# Altium schematic sheet Flyback_schematic.SchDoc: Flyback Converter - EduKit
size A3; Author: DJT, SK & JL; CompanyName: The University of Auckland; Organization: Dept. ECSE; Address1: The University of Auckland; Address2: 20 Symonds Street; Address3: Auckland; Address4: New Zealand; Revision: 2.0; SheetNumber: 1; SheetTotal: 1
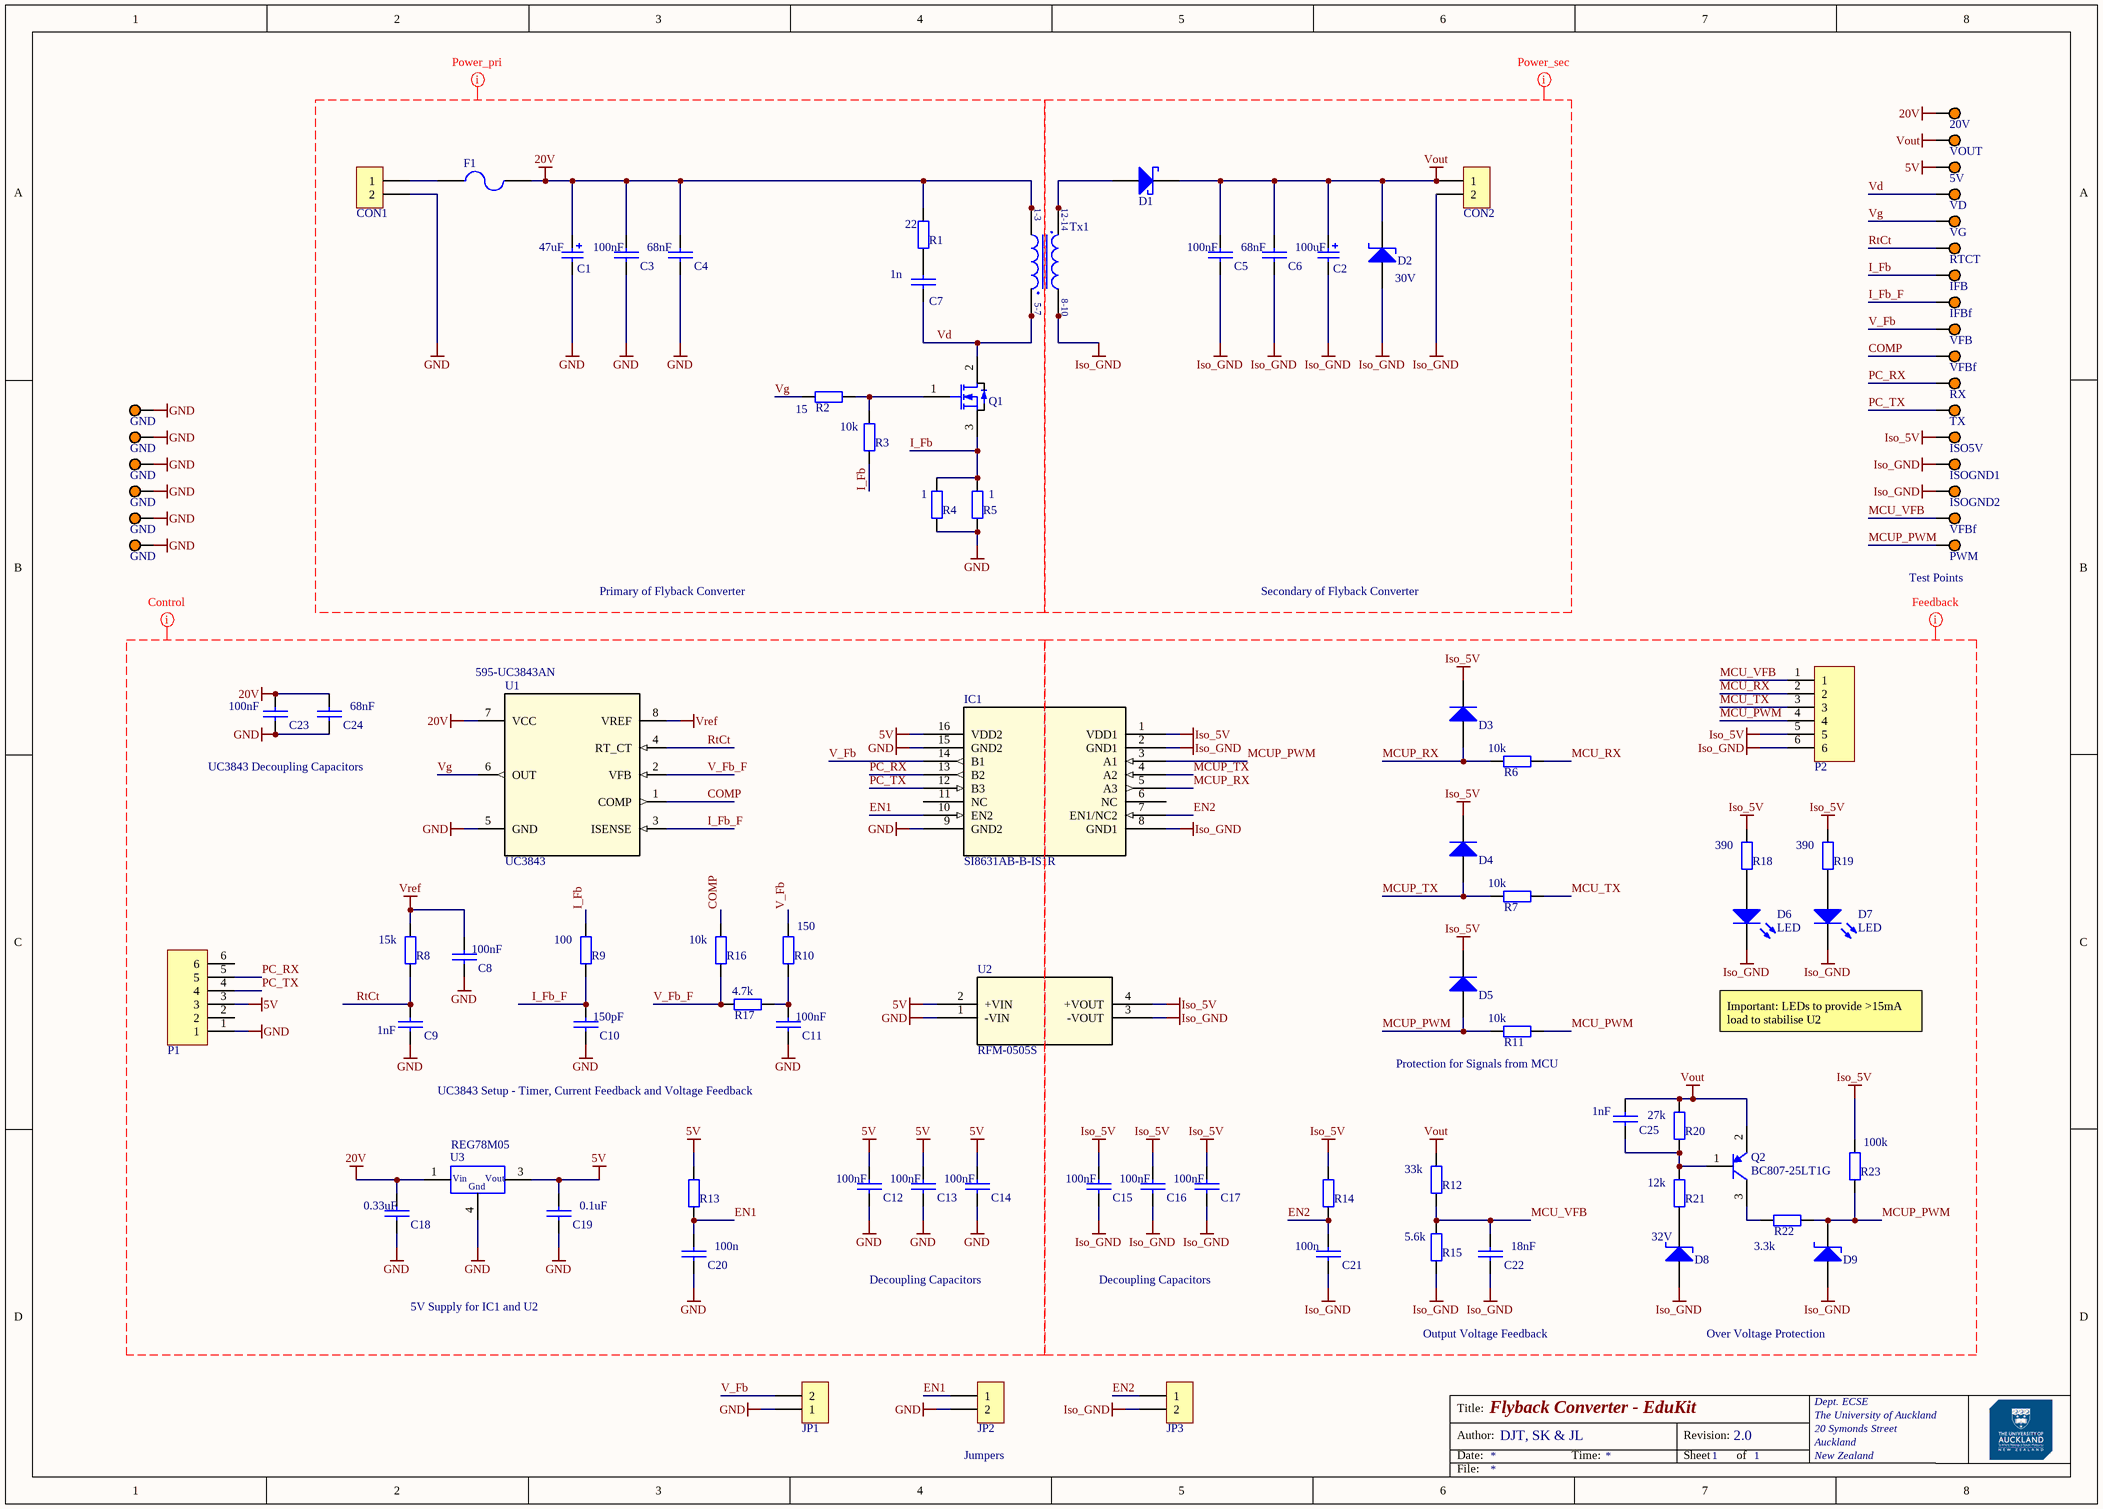
[diagram p0: Flyback_schematic.SchDoc]

## Parts
C1  47uF  [CR05]
C2  100uF  [CR05]
C3  100nF  [C1210]
C4  68nF  [C1210]
C5  100nF  [C1210]
C6  68nF  [C1210]
C7  1n  [C1210]
C8  100nF  [C0805]
C9  1nF  [C0805]
C10  150pF  [C0805]
C11  100nF  [C0805]
C12  100nF  [C0805]
C13  100nF  [C0805]
C14  100nF  [C0805]
C15  100nF  [C0805]
C16  100nF  [C0805]
C17  100nF  [C0805]
C18  0.33uF  [C0805]
C19  0.1uF  [C0805]
C20  100n  [C0805]
C21  100n  [C0805]
C22  18nF  [C0805]
C23  100nF  [C0805]
C24  68nF  [C0805]
C25  1nF  [C0805]
CON1  Header 2X1  [HDR2X1_5]  (value not drawn)
CON2  Header 2X1  [HDR2X1_5]  (value not drawn)
D1  SDT5H100P5  [PowerDI5]  (value not drawn)
D2  30V  [SOD123]
D3  1N4148  [SOD123]  (value not drawn)
D4  1N4148  [SOD123]  (value not drawn)
D5  1N4148  [SOD123]  (value not drawn)
D6  LED  [LED0805]
D7  LED  [LED0805]
D8  32V  [SOD123]
D9  Zener  [SOD123]  (value not drawn)
F1  Fuse Resettable  [0ZCF Series]  (value not drawn)
GND1  GND  [Testpoint - 1mm]
GND2  GND  [Testpoint - 1mm]
GND3  GND  [Testpoint - 1mm]
GND4  GND  [Testpoint - 1mm]
GND5  GND  [Testpoint - 1mm]
GND6  GND  [Testpoint - 1mm]
IC1  SI8631AB-B-IS1R  [SOIC16]
JP1  Header 2X1  [HDR2X1_2P54]  (value not drawn)
JP2  Header 2X1  [HDR2X1_2P54]  (value not drawn)
JP3  Header 2X1  [HDR2X1_2P54]  (value not drawn)
P1  Header 6X1  [HDR6X1_2P54]  (value not drawn)
P2  Header 6X1  [HDR6X1_2P54]  (value not drawn)
Q1  MOSFET  [TO220]  (value not drawn)
Q2  BC807-25LT1G  [SOT23SM]
R1  22  [R1206]
R2  15  [R0805]
R3  10k  [R0805]
R4  1  [R1206]
R5  1  [R1206]
R6  10k  [R0805]
R7  10k  [R0805]
R8  15k  [R0805]
R9  100  [R0805]
R10  150  [R0805]
R11  10k  [R0805]
R12  33k  [R0805]
R13  Resistor 0805  [R0805]  (value not drawn)
R14  Resistor 0805  [R0805]  (value not drawn)
R15  5.6k  [R0805]
R16  10k  [R0805]
R17  4.7k  [R0805]
R18  390  [R0805]
R19  390  [R0805]
R20  27k  [R0805]
R21  12k  [R0805]
R22  3.3k  [R0805]
R23  100k  [R0805]
TP1  20V  [Testpoint - 1mm]
TP2  VOUT  [Testpoint - 1mm]
TP3  VG  [Testpoint - 1mm]
TP4  PWM  [Testpoint - 1mm]
TP6  IFB  [Testpoint - 1mm]
TP7  VFB  [Testpoint - 1mm]
TP8  RX  [Testpoint - 1mm]
TP9  5V  [Testpoint - 1mm]
TP10  ISO5V  [Testpoint - 1mm]
TP11  ISOGND1  [Testpoint - 1mm]
TP12  TX  [Testpoint - 1mm]
TP13  ISOGND2  [Testpoint - 1mm]
TP14  RTCT  [Testpoint - 1mm]
TP15  IFBf  [Testpoint - 1mm]
TP16  VFBf  [Testpoint - 1mm]
TP17  VFBf  [Testpoint - 1mm]
Tx1  Inductor  [ETD34]  (value not drawn)
U1  UC3843  Supplier Part Number 1: 595-UC3843AN  [DIP-8]
U2  RFM-0505S  [RFM-0505S_RCP]
U3  REG78M05  [TO252]
VD  VD  [Testpoint - 1mm]

## Nets
5V: C12.2 C13.2 C14.2 C19.2 IC1.16(VDD2) P1.3 R13.2 TP9.1 U2.2(+VIN) U3.3(Vout)
20V: C1.1 C3.2 C4.2 C18.2 C23.2 C24.2 F1.2 R1.2 TP1.1 Tx1.1 Tx1.2 Tx1.3 U1.7(VCC) U3.1(Vin)
GND: C1.2 C3.1 C4.1 C8.1 C9.1 C10.1 C11.1 C12.1 C13.1 C14.1 C18.1 C19.1 C20.1 C23.1 C24.1 CON1.2 GND1.1 GND2.1 GND3.1 GND4.1 GND5.1 GND6.1 IC1.9(GND2) IC1.15(GND2) JP1.1 JP2.2 P1.1 R4.1 R5.1 U1.5(GND) U2.1(-VIN) U3.4(Gnd)
Iso_5V: C15.2 C16.2 C17.2 D3.2 D4.2 D5.2 IC1.1(VDD1) P2.5 R14.2 R18.2 R19.2 R23.2 TP10.1 U2.4(+VOUT)
Iso_GND: C2.2 C5.1 C6.1 C15.1 C16.1 C17.1 C21.1 C22.1 CON2.2 D2.1(A) D6.2(K) D7.2(K) D8.1(A) D9.1(A) IC1.2(GND1) IC1.8(GND1) JP3.2 P2.6 R15.1 TP11.1 TP13.1 Tx1.8 Tx1.9 Tx1.10 U2.3(-VOUT)
Vout: C2.1 C5.2 C6.2 C25.2 CON2.1 D1.3(K) D2.2(K) Q2.2(E) R12.2 R20.2 TP2.1
Vref: C8.2 R8.1 U1.8(VREF)
COMP: R16.2 TP16.1 U1.1(COMP)
EN1: C20.2 IC1.10(EN2) JP2.1 R13.1
EN2: C21.2 IC1.7(EN1/NC2) JP3.1 R14.1
I_Fb: Q1.3(S) R3.1 R4.2 R5.2 R9.2 TP6.1
I_Fb_F: C10.2 R9.1 TP15.1 U1.3(ISENSE)
MCU_PWM: P2.4 R11.1
MCU_RX: P2.2 R6.1
MCU_TX: P2.3 R7.1
MCU_VFB: C22.2 P2.1 R12.1 R15.2 TP17.1
MCUP_PWM: D5.1 D9.2(K) IC1.3(A1) R11.2 R22.2 R23.1 TP4.1
MCUP_RX: D3.1 IC1.5(A3) R6.2
MCUP_TX: D4.1 IC1.4(A2) R7.2
PC_RX: IC1.13(B2) P1.5 TP8.1
PC_TX: IC1.12(B3) P1.4 TP12.1
RtCt: C9.2 R8.2 TP14.1 U1.4(RT_CT)
V_Fb: IC1.14(B1) JP1.2 R10.2 TP7.1
V_Fb_F: R16.1 R17.2 U1.2(VFB)
Vd: C7.1 Q1.2(D) Tx1.5 Tx1.6 Tx1.7 VD.1
Vg: R2.1 TP3.1 U1.6(OUT)
NetC7_2: C7.2 R1.1
NetC11_2: C11.2 R10.1 R17.1
NetC25_1: C25.1 Q2.1(B) R20.1 R21.2
NetCON1_1: CON1.1 F1.1
NetD1_1: D1.1(A) Tx1.12 Tx1.13 Tx1.14
NetD6_1: D6.1(A) R18.1
NetD7_1: D7.1(A) R19.1
NetD8_2: D8.2(K) R21.1
NetQ1_1: Q1.1(G) R2.2 R3.2
NetQ2_3: Q2.3(C) R22.1

Not connected (* = marked no-connect by the designer): IC1 6(NC) 11(NC); P1 2 6

## Layout directives
net class Power_pri: 20V, GND, I_Fb, Vd, Vg
net class Power_sec: Iso_GND, Vout
net class Control_pri: 5V, 20V, COMP, EN1, GND, I_Fb, I_Fb_F, PC_RX, PC_TX, RtCt, V_Fb, V_Fb_F, Vg, Vref
net class Feedback_sec: EN2, Iso_5V, Iso_GND, MCU_PWM, MCU_RX, MCU_TX, MCU_VFB, MCUP_PWM, MCUP_RX, MCUP_TX, Vout

## Notes on the sheet
- (near TP4) Test Points
- Primary of Flyback Converter
- Secondary of Flyback Converter
- UC3843 Decoupling Capacitors
- Important: LEDs to provide >15mA load to stabilise U2
- UC3843 Setup - Timer, Current Feedback and Voltage Feedback
- (near R11) Protection for Signals from MCU
- 5V Supply for IC1 and U2
- Decoupling Capacitors
- Output Voltage Feedback
- Over Voltage Protection
- (near JP2) Jumpers
- Title:
- Author:
- Date:
- Time:
- Revision:
- Sheet
- of
- File:
- (in symbol Transformer EFD34) 1-3; 12-14; 8-10; 5-7

## Library data of the parts
C1 C2 = ECAP
C3-C7 = CCAP1210
C8-C25 = CCAP0805
CON1 CON2 JP1-JP3 = HDR2X1
D1 = SDT5H100P5: Schottky Diode; Supplier 1: Digi-Key; Supplier Part Number 1: SDT5H100P5-7DIDKR-ND
D2 D8 D9 = Zener: Zener Diode
D3-D5 = 1N4148: Signal Diode - 1N4148; Supplier 1: Digi-Key; Supplier Part Number 1: 1N4148WTCT-ND
F1 = FuseResettable 0ZCF0100AF2A: PTC RESET FUSE 60V 1A 2920; Manufacturer: Bel Fuse Inc.; Type: Surface mount; Value: 60V/1A; MPN: 0ZCF0100AF2A; Part Description: PTC RESET FUSE 60V 1A 2920; Supplier Part Number 2: 530-0ZCF0100AF2A; Supplier Part Number 1: 507-2070-1-ND; Supplier 2: Mouser; Supplier 1: Digi-Key
GND1-GND6 TP1-TP4 TP6-TP17 VD = TP: Testpoint
IC1 = SI8631AB-B-IS1R: No Description Available; SourceLibrary: Silicon_Labs_2020-10-01; Vendor: Silicon Labs; Datasheet: https://www.silabs.com/documents/public/data-sheets/si86xx-1Mbps-datasheet.pdf; Copyright: Copyright (C) 2018 Accelerated Designs. All rights reserved; Manufacturer_Part_Number: SI8631AB-B-IS1R; RefDes: RefDes; Type: DEV
P1 P2 = HDR6X1: Header, 6-Pin; LatestRevisionDate: 17-Jul-2002; LatestRevisionNote: Re-released for DXP Platform.; Publisher: Altium Limited
Q1 = NFET1: NFET TO220
Q2 = BC807: General Purpose Transistor, PNP Silicon, 3-Pin SOT-23, Pb-Free, Tape and Reel; Manufacturer: On Semiconductor; IC Continuous (A): -0.5; fT Min (MHz): 100; PackageDescription: 3-Pin Small Outline Transistor, Body 2.92 x 1.3 mm, Pitch 0.95 mm; Polarity: PNP; ComponentLink2URL: http://www.onsemi.com/pub_link/Collateral/BC807-16LT1-D.PDF; PackageReference: SOT-23-3-318-08; ComponentLink2Description: Datasheet; ComponentLink1Description: Manufacturer URL; PartNumber: BC807-25LT1G; ComponentLink3URL: http://www.onsemi.cn/pub_link/Collateral/318-08.PDF; Packing: Tape and Reel; DatasheetVersion: Rev. 10; RoHS: TRUE; ComponentLink3Description: Package Specification; PackageVersion: Rev. AP, 11/2009; ComponentLink1URL: http://www.onsemi.com/; Mounting Technology: Surface Mount
R1 R4 R5 = RES1206
R2 R3 R6-R23 = RES0805
Tx1 = Transformer EFD34: Inductor with core
U1 = UC3843: No Description Available; PartNumber: UC3843N; Manufacturer: Texas Instruments; RefDes: RefDes; Type: DEV; Value: UC3843; Copyright: Copyright (C) 2018 Accelerated Designs. All rights reserved; Supplier 1: Mouser
U2 = RFM-0505S: No Description Available; Vendor: Recom Power; Built_By: EMA_Cory; SourceLibrary: Recom_Power_2020-01-16; Manufacturer_Part_Number: RFM-0505S; Copyright: Copyright (C) 2018 Accelerated Designs. All rights reserved; RefDes: RefDes; Type: DEV
U3 = REG78MXX: 78M Series Linear Regulators